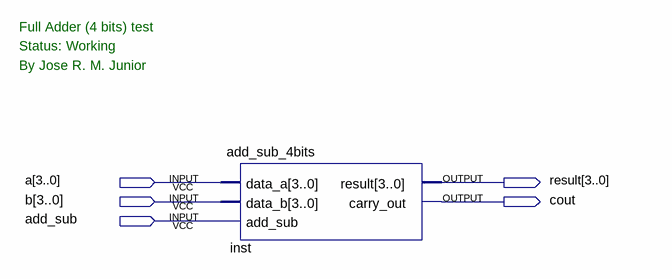
[diagram p0: schematic sheet]
// Quartus schematic add_sub_4bits_test.bdf as structural Verilog: 1 symbols, 5 pins
module add_sub_4bits_test (
  input  [3:0] a,
  input  [3:0] b,
  input  add_sub,
  output [3:0] result,
  output cout
);

  add_sub_4bits inst (.data_a(a), .data_b(b), .add_sub(add_sub), .result(result), .carry_out(cout));

  // Notes on the sheet:
  //   Full Adder (4 bits) test
  //   Status: Working
  //   By Jose R. M. Junior
endmodule
